# EAGLE design untitled (EAGLE 9.6.2)
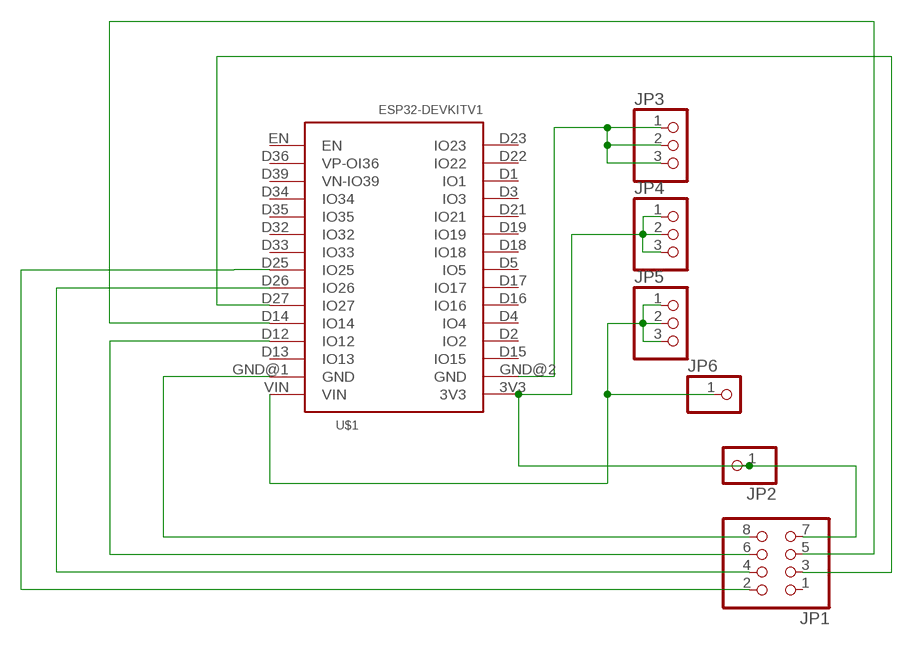
[diagram p0: schematic, sheet 1]

## Parts
JP1  PINHD-2X4  [2X04]
JP2  PINHD-1X1  [1X01]
JP3  PINHD-1X3  [1X03]
JP4  PINHD-1X3  [1X03]
JP5  PINHD-1X3  [1X03]
JP6  PINHD-1X1  [1X01]
U$1  ESP32DEVKITV1  [ESP32-DEVKITV1]

## Nets
N$1: JP1.8 U$1.GND@1(GND)
N$2: JP3.1 JP3.2 JP3.3 U$1.GND@2(GND)
N$3: JP1.4 U$1.D26(IO26)
N$4: JP1.2 U$1.D25(IO25)
N$6: JP1.7 JP2.1 JP4.1 JP4.2 JP4.3 U$1.3V3
N$7: JP1.3 U$1.D27(IO27)
N$8: JP5.1 JP5.2 JP5.3 JP6.1 U$1.VIN
N$9: JP1.6 U$1.D12(IO12)
N$10: JP1.5 U$1.D14(IO14)
Unconnected: JP1.1 U$1.D1(IO1) U$1.D2(IO2) U$1.D3(IO3) U$1.D4(IO4) U$1.D5(IO5) U$1.D13(IO13) U$1.D15(IO15) U$1.D16(IO16) U$1.D17(IO17) U$1.D18(IO18) U$1.D19(IO19) U$1.D21(IO21) U$1.D22(IO22) U$1.D23(IO23) U$1.D32(IO32) U$1.D33(IO33) U$1.D34(IO34) U$1.D35(IO35) U$1.D36(VP-OI36) U$1.D39(VN-IO39) U$1.EN

## Library data of the parts
JP1 = adafruit:PINHD-2X4: PIN HEADER
JP2 JP6 = adafruit:PINHD-1X1: Pin header 1x1 for 0.1" spacing With round pins
JP3-JP5 = adafruit:PINHD-1X3: PIN HEADER
U$1 = ESP32-DEVKITV1 (1):ESP32DEVKITV1

## Board
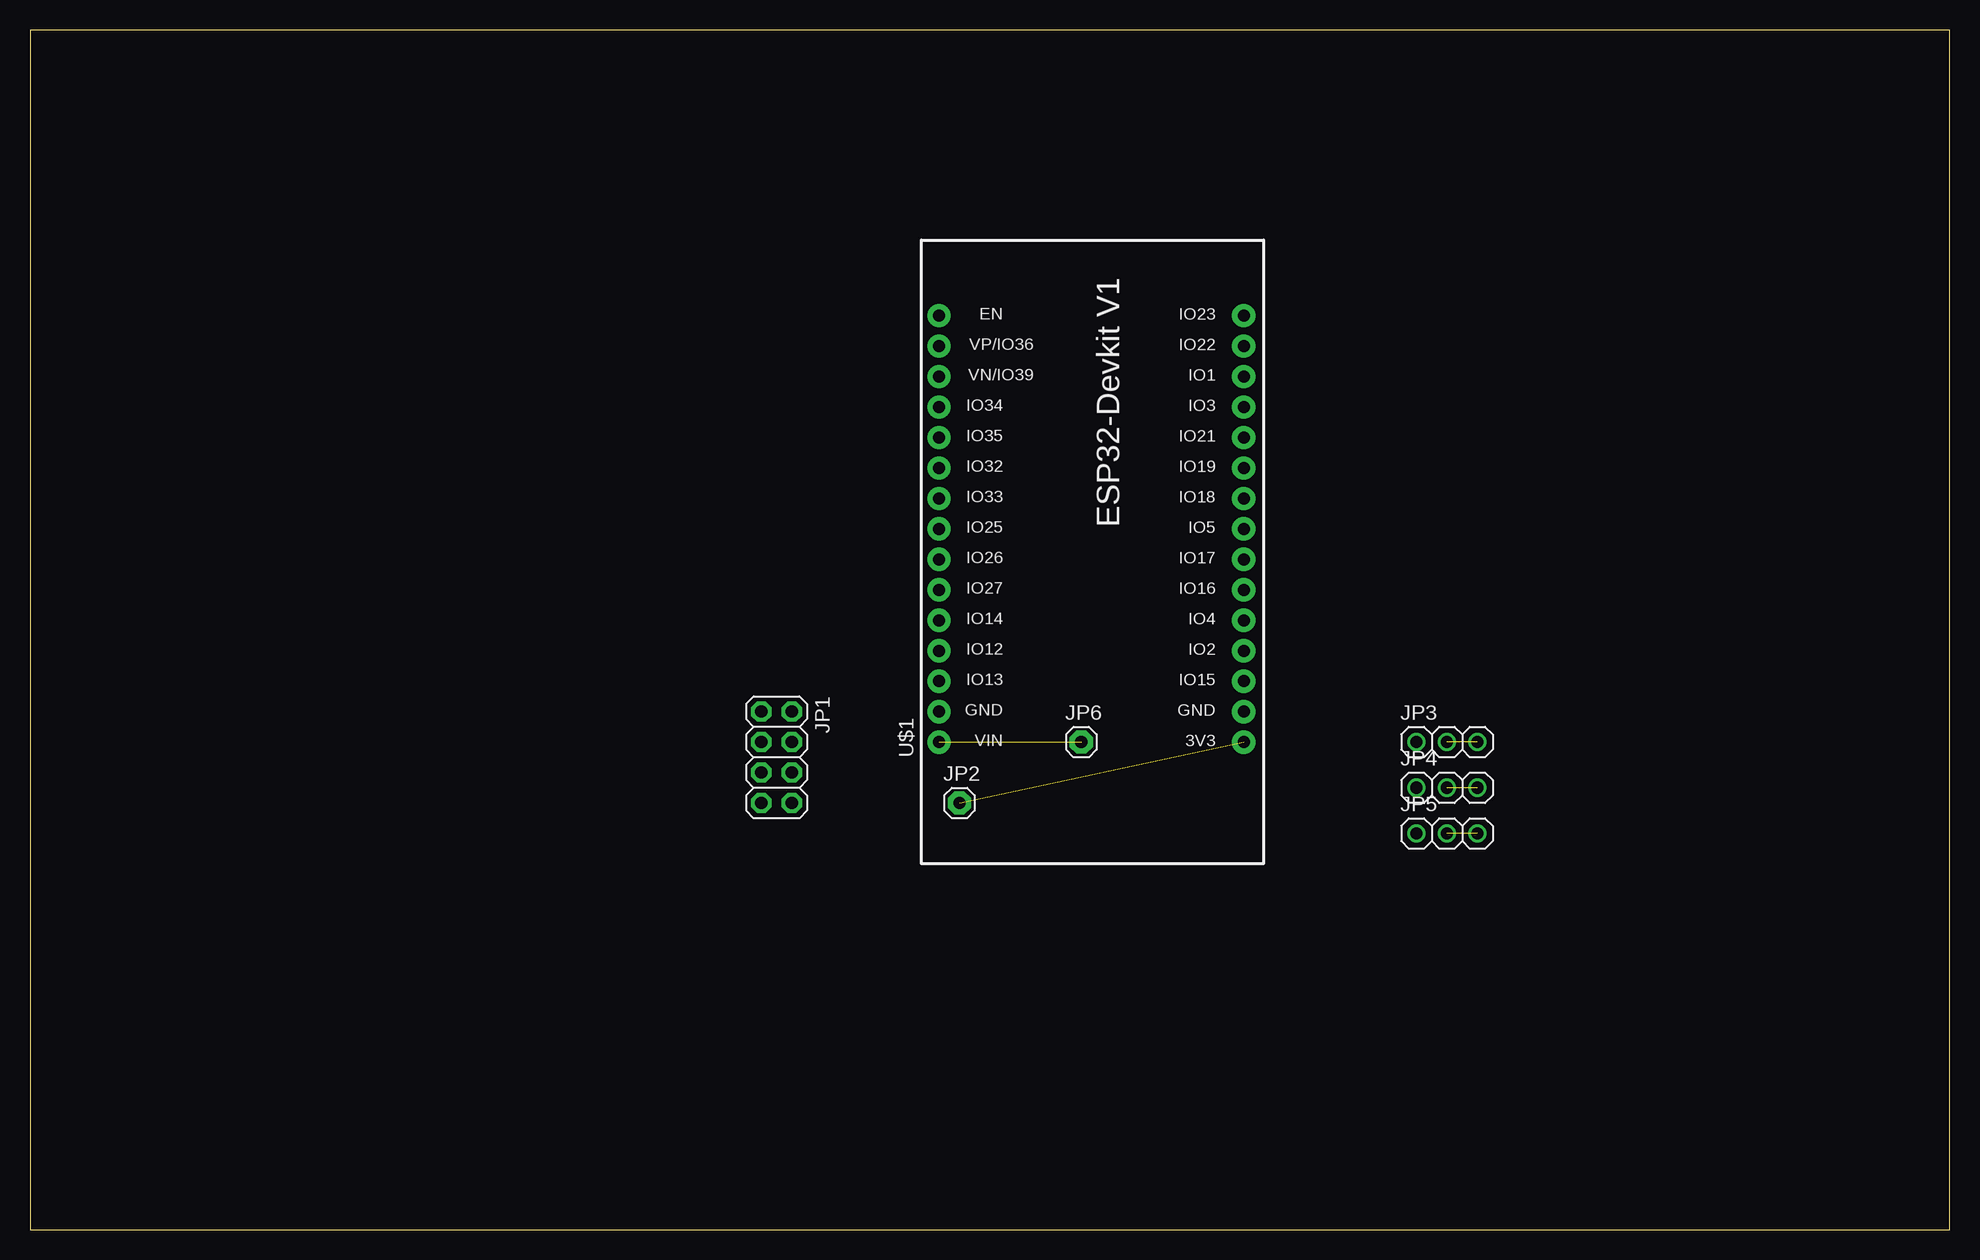
[diagram p1: board, top side]
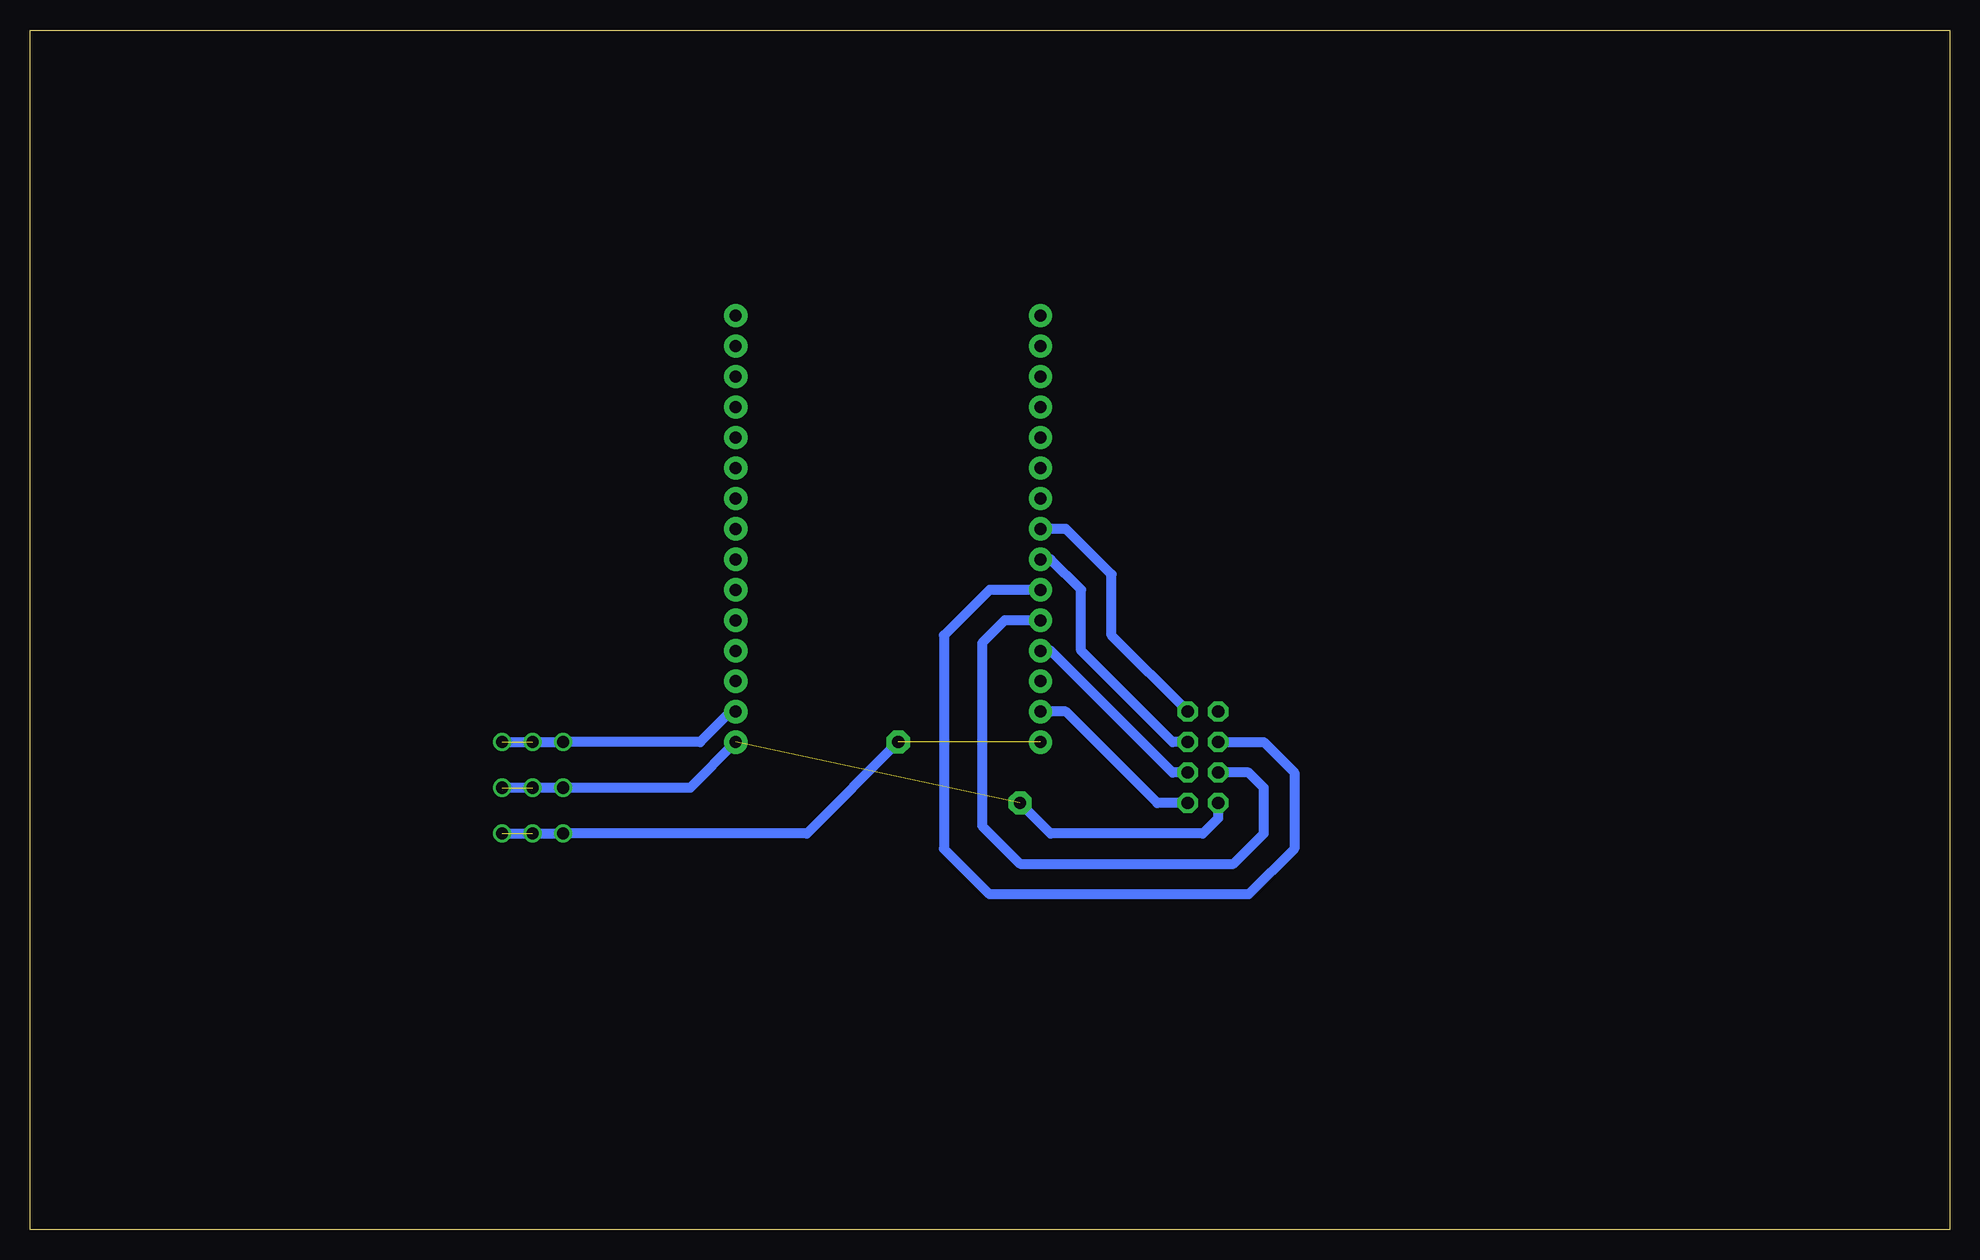
[diagram p2: board, bottom side, seen from below]

Size 160 x 100 mm. Coordinates in mm from the lower left corner, seen from the top.
Outline: 0,0 160,0 160,100 0,100 0,0
Copper layers (1*16): Top 0.035mm / dielectric 1.5mm / Bottom 0.035mm
Design rules "default": minimum track width 6mil, minimum drill 0.35mm, track to track 6mil, track to pad 6mil, pad to pad 6mil, via to via 6mil, smd to smd 6mil, copper to edge 40mil, drill to drill 6mil, minimum pad ring 10mil, minimum via ring 8mil, stop-mask expansion 4mil, vias tented up to drill 0mil, thermal gap 10mil

### Footprints (pad centres in the part's own frame; a part is rotated, then mirrored left to right if it is on the bottom)
2X04 = drill 1.016 pad 1.676 octagon: 1 -3.81,-1.27; 2 -3.81,1.27; 3 -1.27,-1.27; 4 -1.27,1.27; 5 1.27,-1.27; 6 1.27,1.27; 7 3.81,-1.27; 8 3.81,1.27
1X01 = drill 1.016 pad 1.93 octagon: 1 0,0
1X03 = drill 1.016: 1 -2.54,0; 2 0,0; 3 2.54,0
ESP32-DEVKITV1 = drill 1 pad 1.93: 3V3 -16.52,-12.27; D1 13.96,-12.27; D2 -8.9,-12.27; D3 11.42,-12.27; D4 -6.36,-12.27; D5 1.26,-12.27; D12 -8.9,13.135; D13 -11.44,13.135; D14 -6.36,13.135; D15 -11.44,-12.27; D16 -3.82,-12.27; D17 -1.28,-12.27; D18 3.8,-12.27; D19 6.34,-12.27; D21 8.88,-12.27; D22 16.5,-12.27; D23 19.04,-12.27; D25 1.26,13.135; D26 -1.28,13.135; D27 -3.82,13.135; D32 6.34,13.135; D33 3.8,13.135; D34 11.42,13.135; D35 8.88,13.135; D36 16.5,13.135; D39 13.96,13.135; EN 19.04,13.135; GND@1 -13.98,13.135; GND@2 -13.98,-12.27; VIN -16.52,13.135

### Placement (x,y rotation side)
JP1  62.23,39.37 270 top
JP2  77.47,35.56 0 top
JP3  118.11,40.64 0 top
JP4  118.11,36.83 0 top
JP5  118.11,33.02 0 top
JP6  87.63,40.64 0 top
U$1  88.9,57.15 90 top

### Tracks (layer width: path | path; a pad name or v marks a point on that pad's centre or on a via)
N$1
  Bottom 0.813: JP1.8 66.04,35.56 73.66,43.18 75.75,43.18 U$1.GND@1
N$2  (1 unrouted)
  Bottom 0.813: JP3.3 JP3.1 104.14,40.64 101.61,43.17 U$1.GND@2
N$3
  Bottom 0.813: JP1.4 64.77,40.64 72.39,48.26 72.39,53.34 74.92,55.87 U$1.D26
N$4
  Bottom 0.813: JP1.2 69.85,49.53 69.85,54.61 73.65,58.41 U$1.D25
N$6  (2 unrouted)
  Bottom 0.813: JP4.3 JP4.1 104.97,36.83 U$1.3V3 | JP1.7 60.96,34.29 62.23,33.02 74.93,33.02 JP2.1
N$7
  Bottom 0.813: JP1.3 57.15,40.64 54.61,38.1 54.61,31.75 58.42,27.94 80.01,27.94 83.82,31.75 83.82,49.53 80.02,53.33 U$1.D27
N$8  (2 unrouted)
  Bottom 0.813: JP6.1 95.25,33.02 JP5.1 JP5.3
N$9
  Bottom 0.813: JP1.6 64.77,38.1 74.93,48.26 75.75,48.26 U$1.D12
N$10
  Bottom 0.813: U$1.D14 78.73,50.79 78.74,50.8 80.64,48.9 80.64,33.66 77.47,30.48 59.69,30.48 57.15,33.02 57.15,36.83 58.42,38.1 JP1.5